# EAGLE schematic dachshund104 (EAGLE 9.7.0)
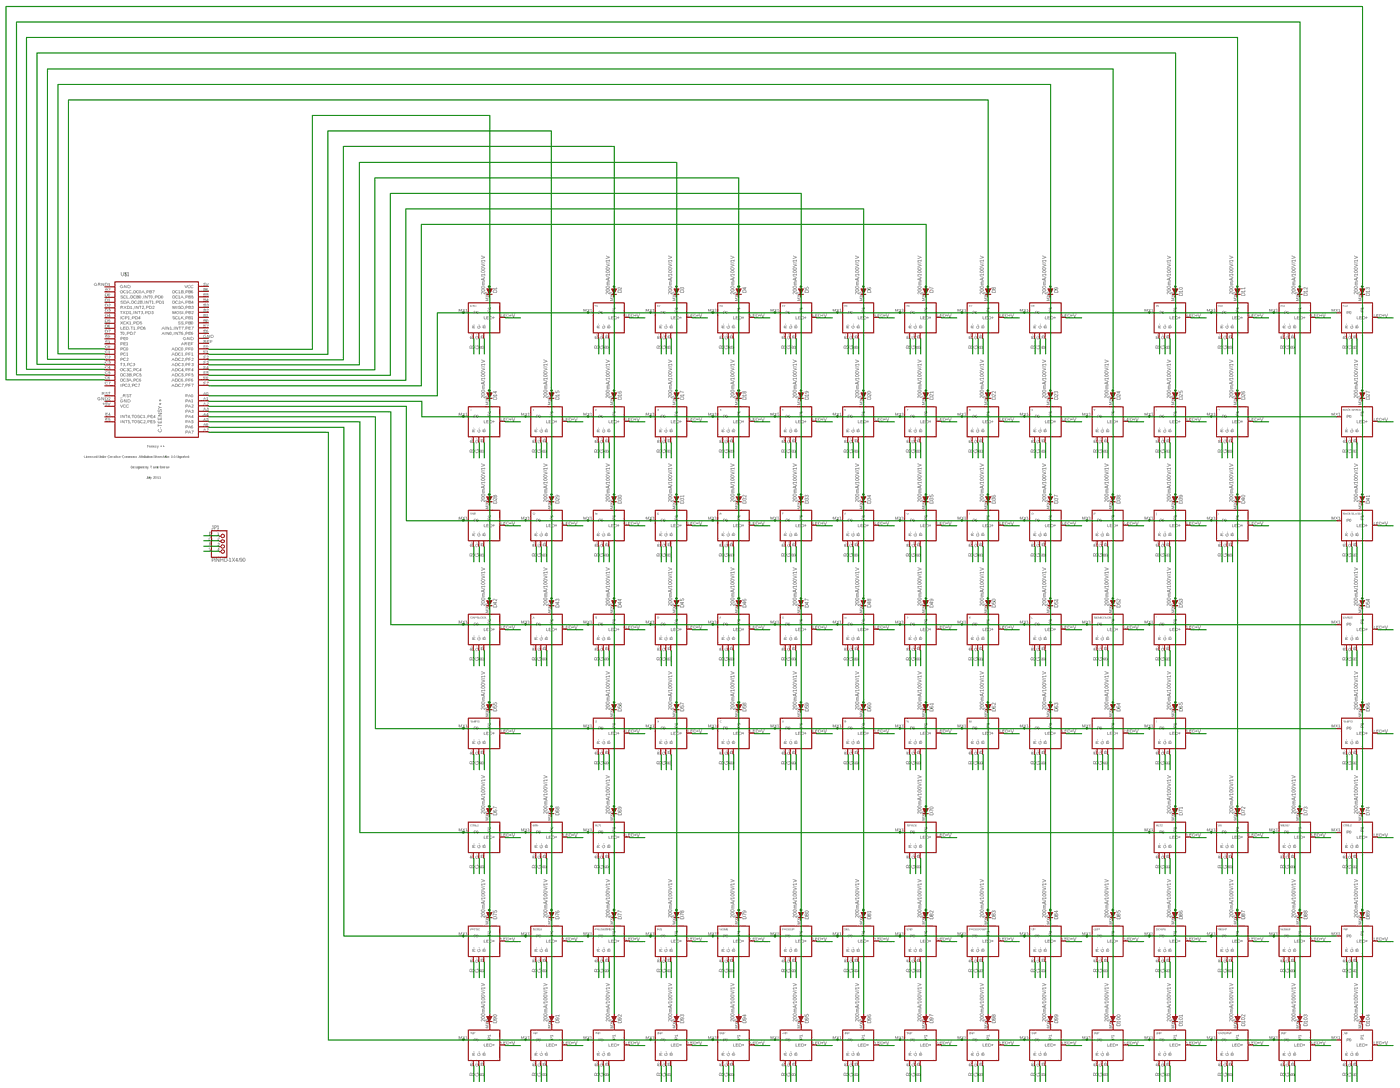
[diagram p0: schematic, sheet 1, overview]
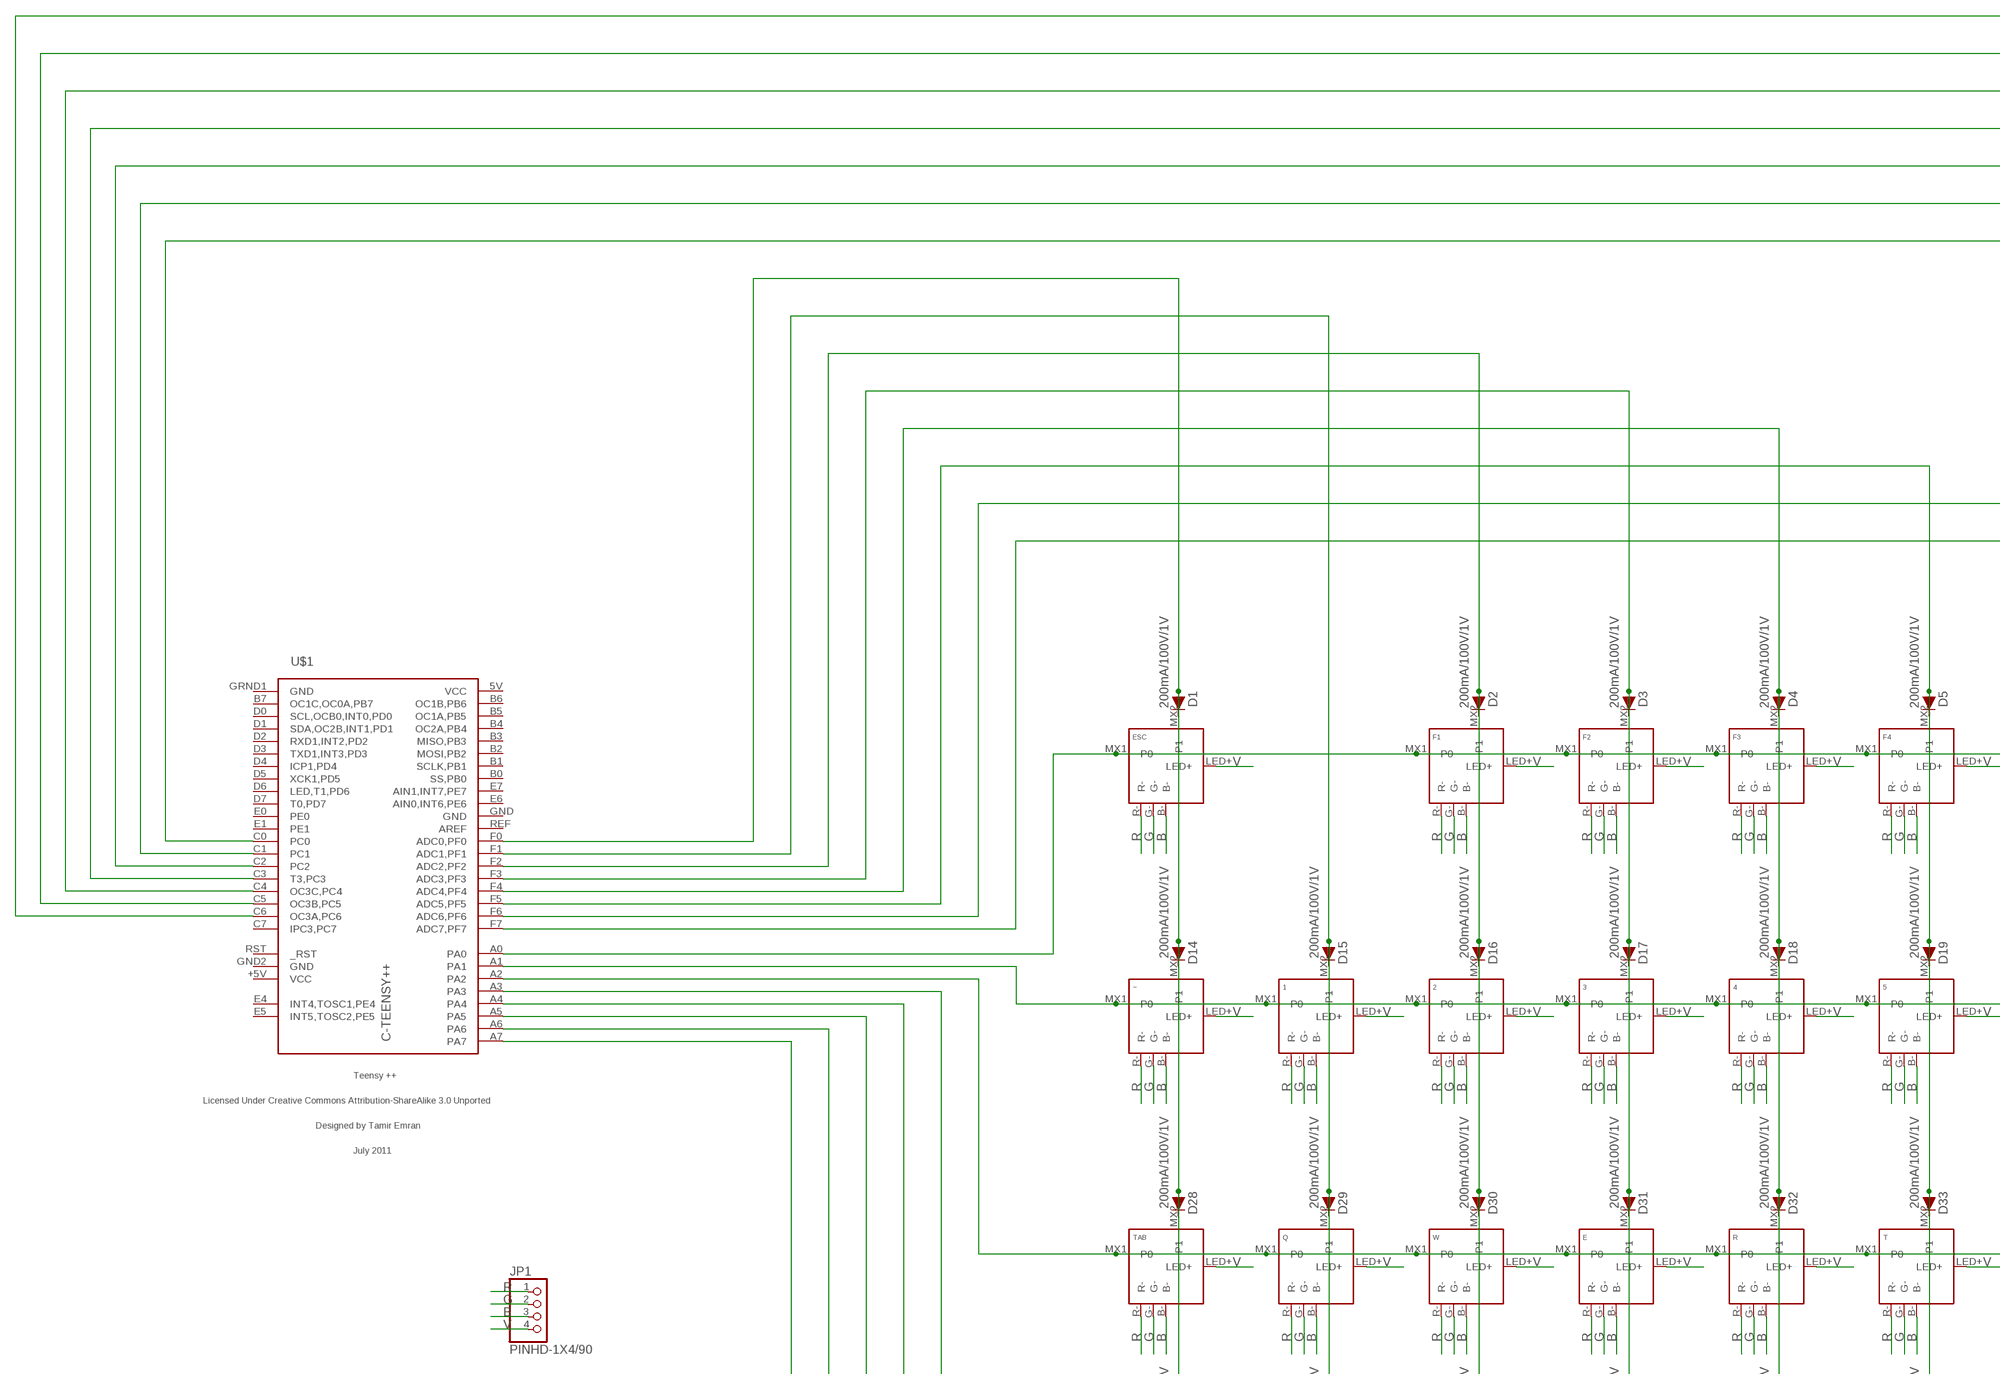
[diagram p1: schematic, sheet 1, part 1 of 4]
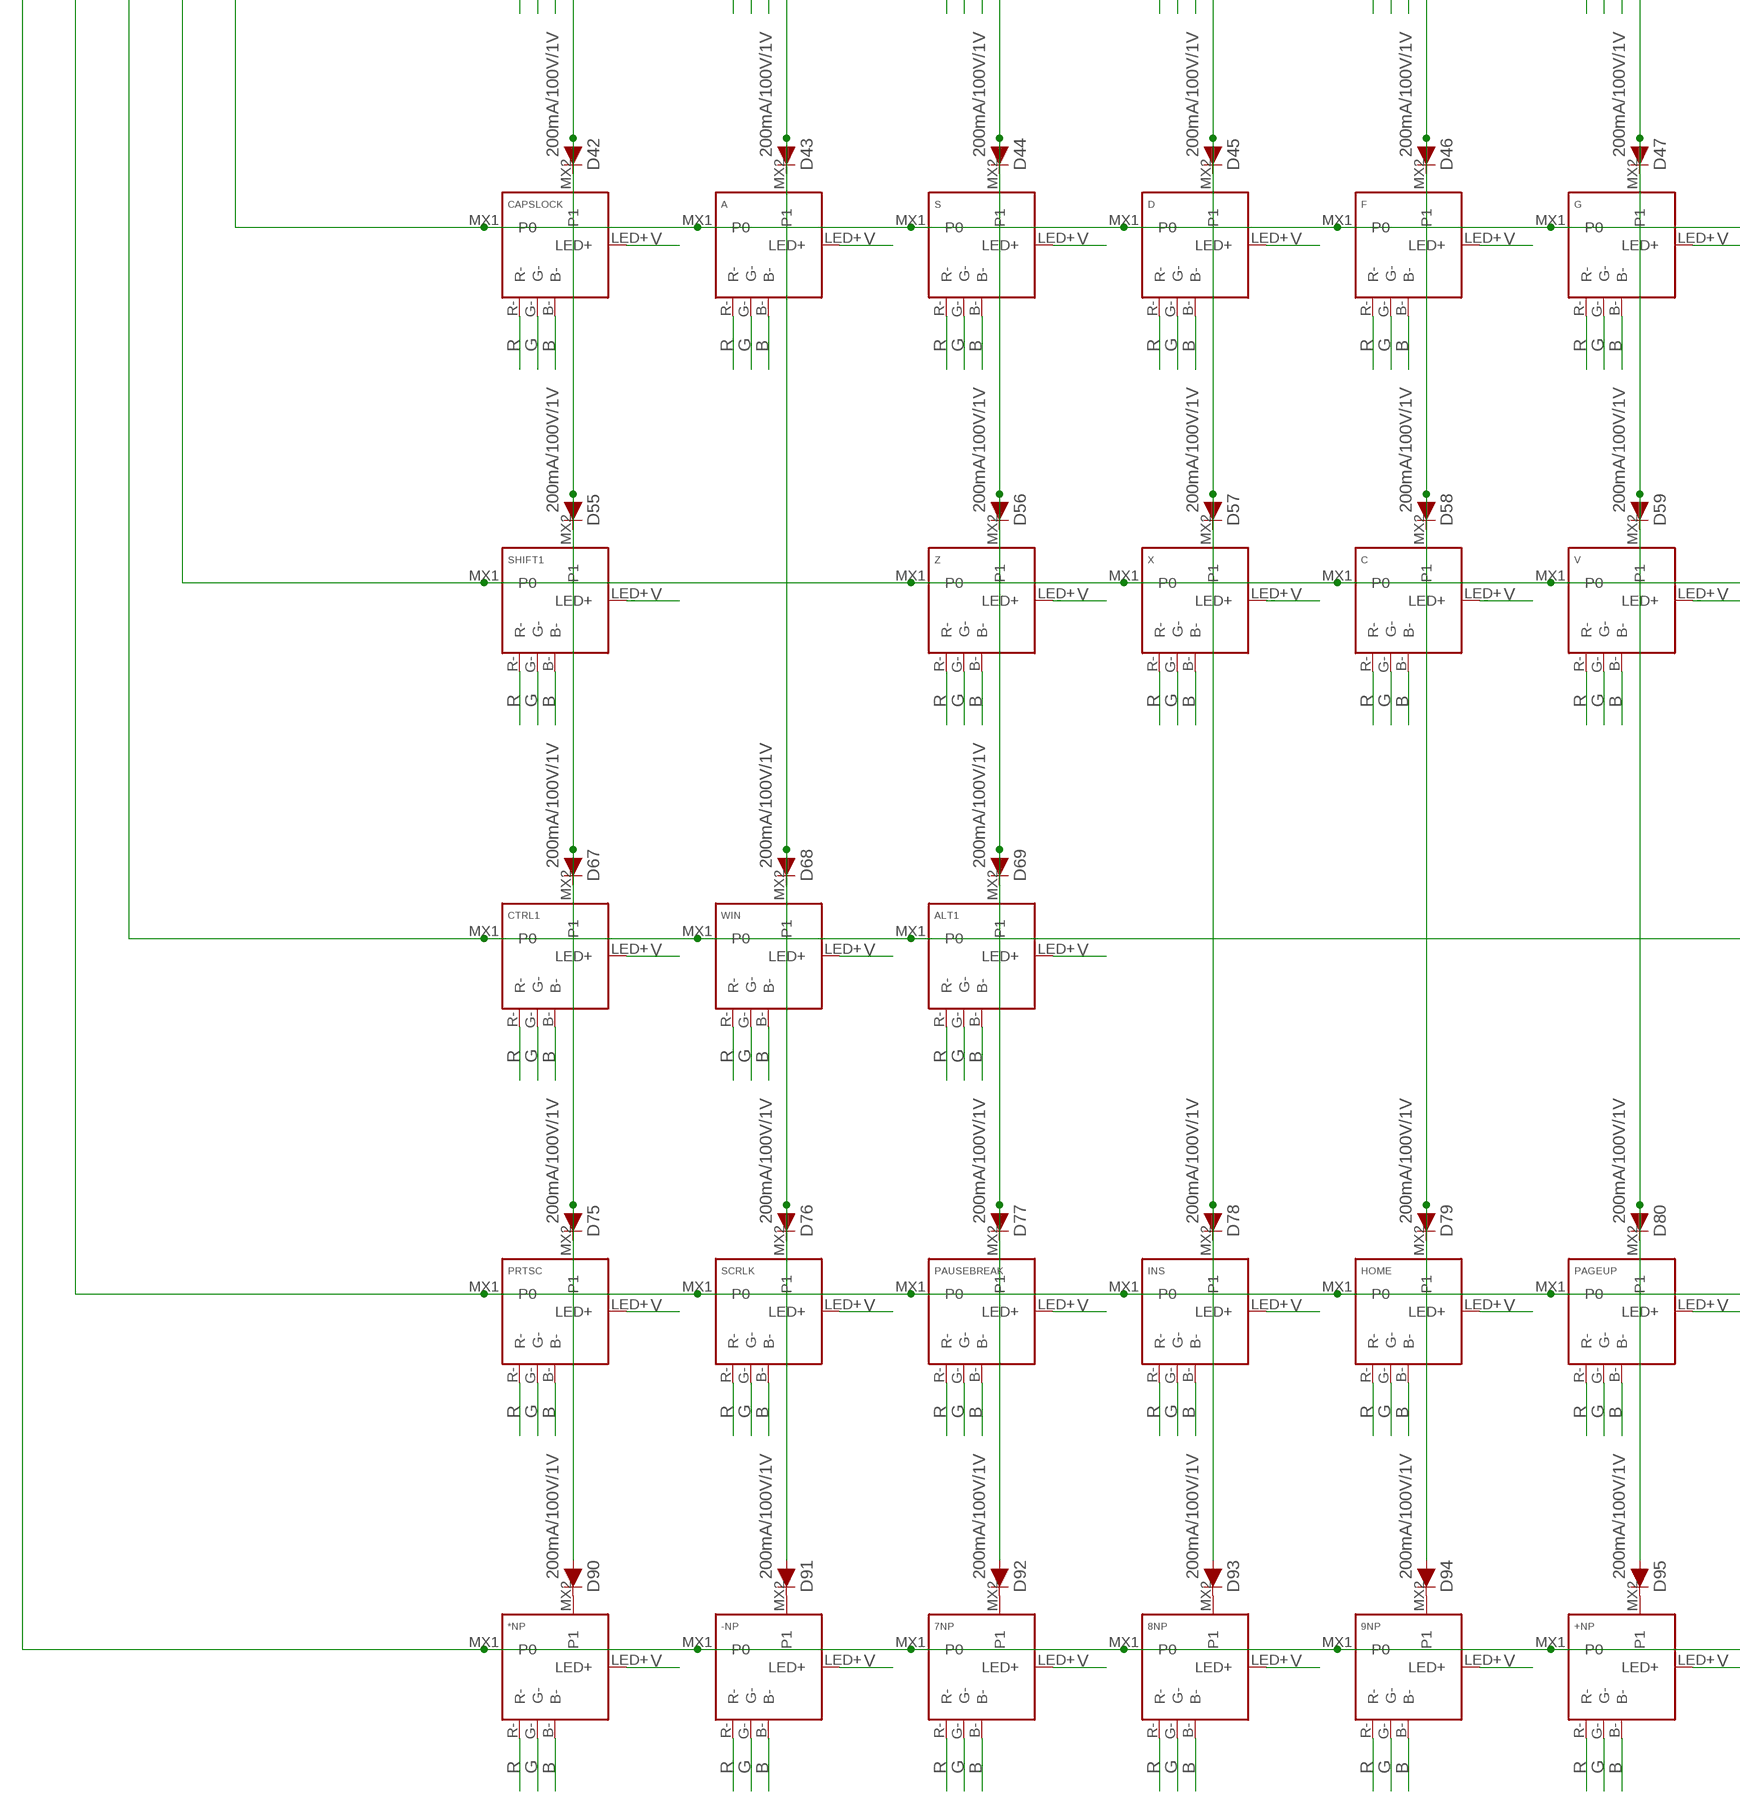
[diagram p2: schematic, sheet 1, part 2 of 4]
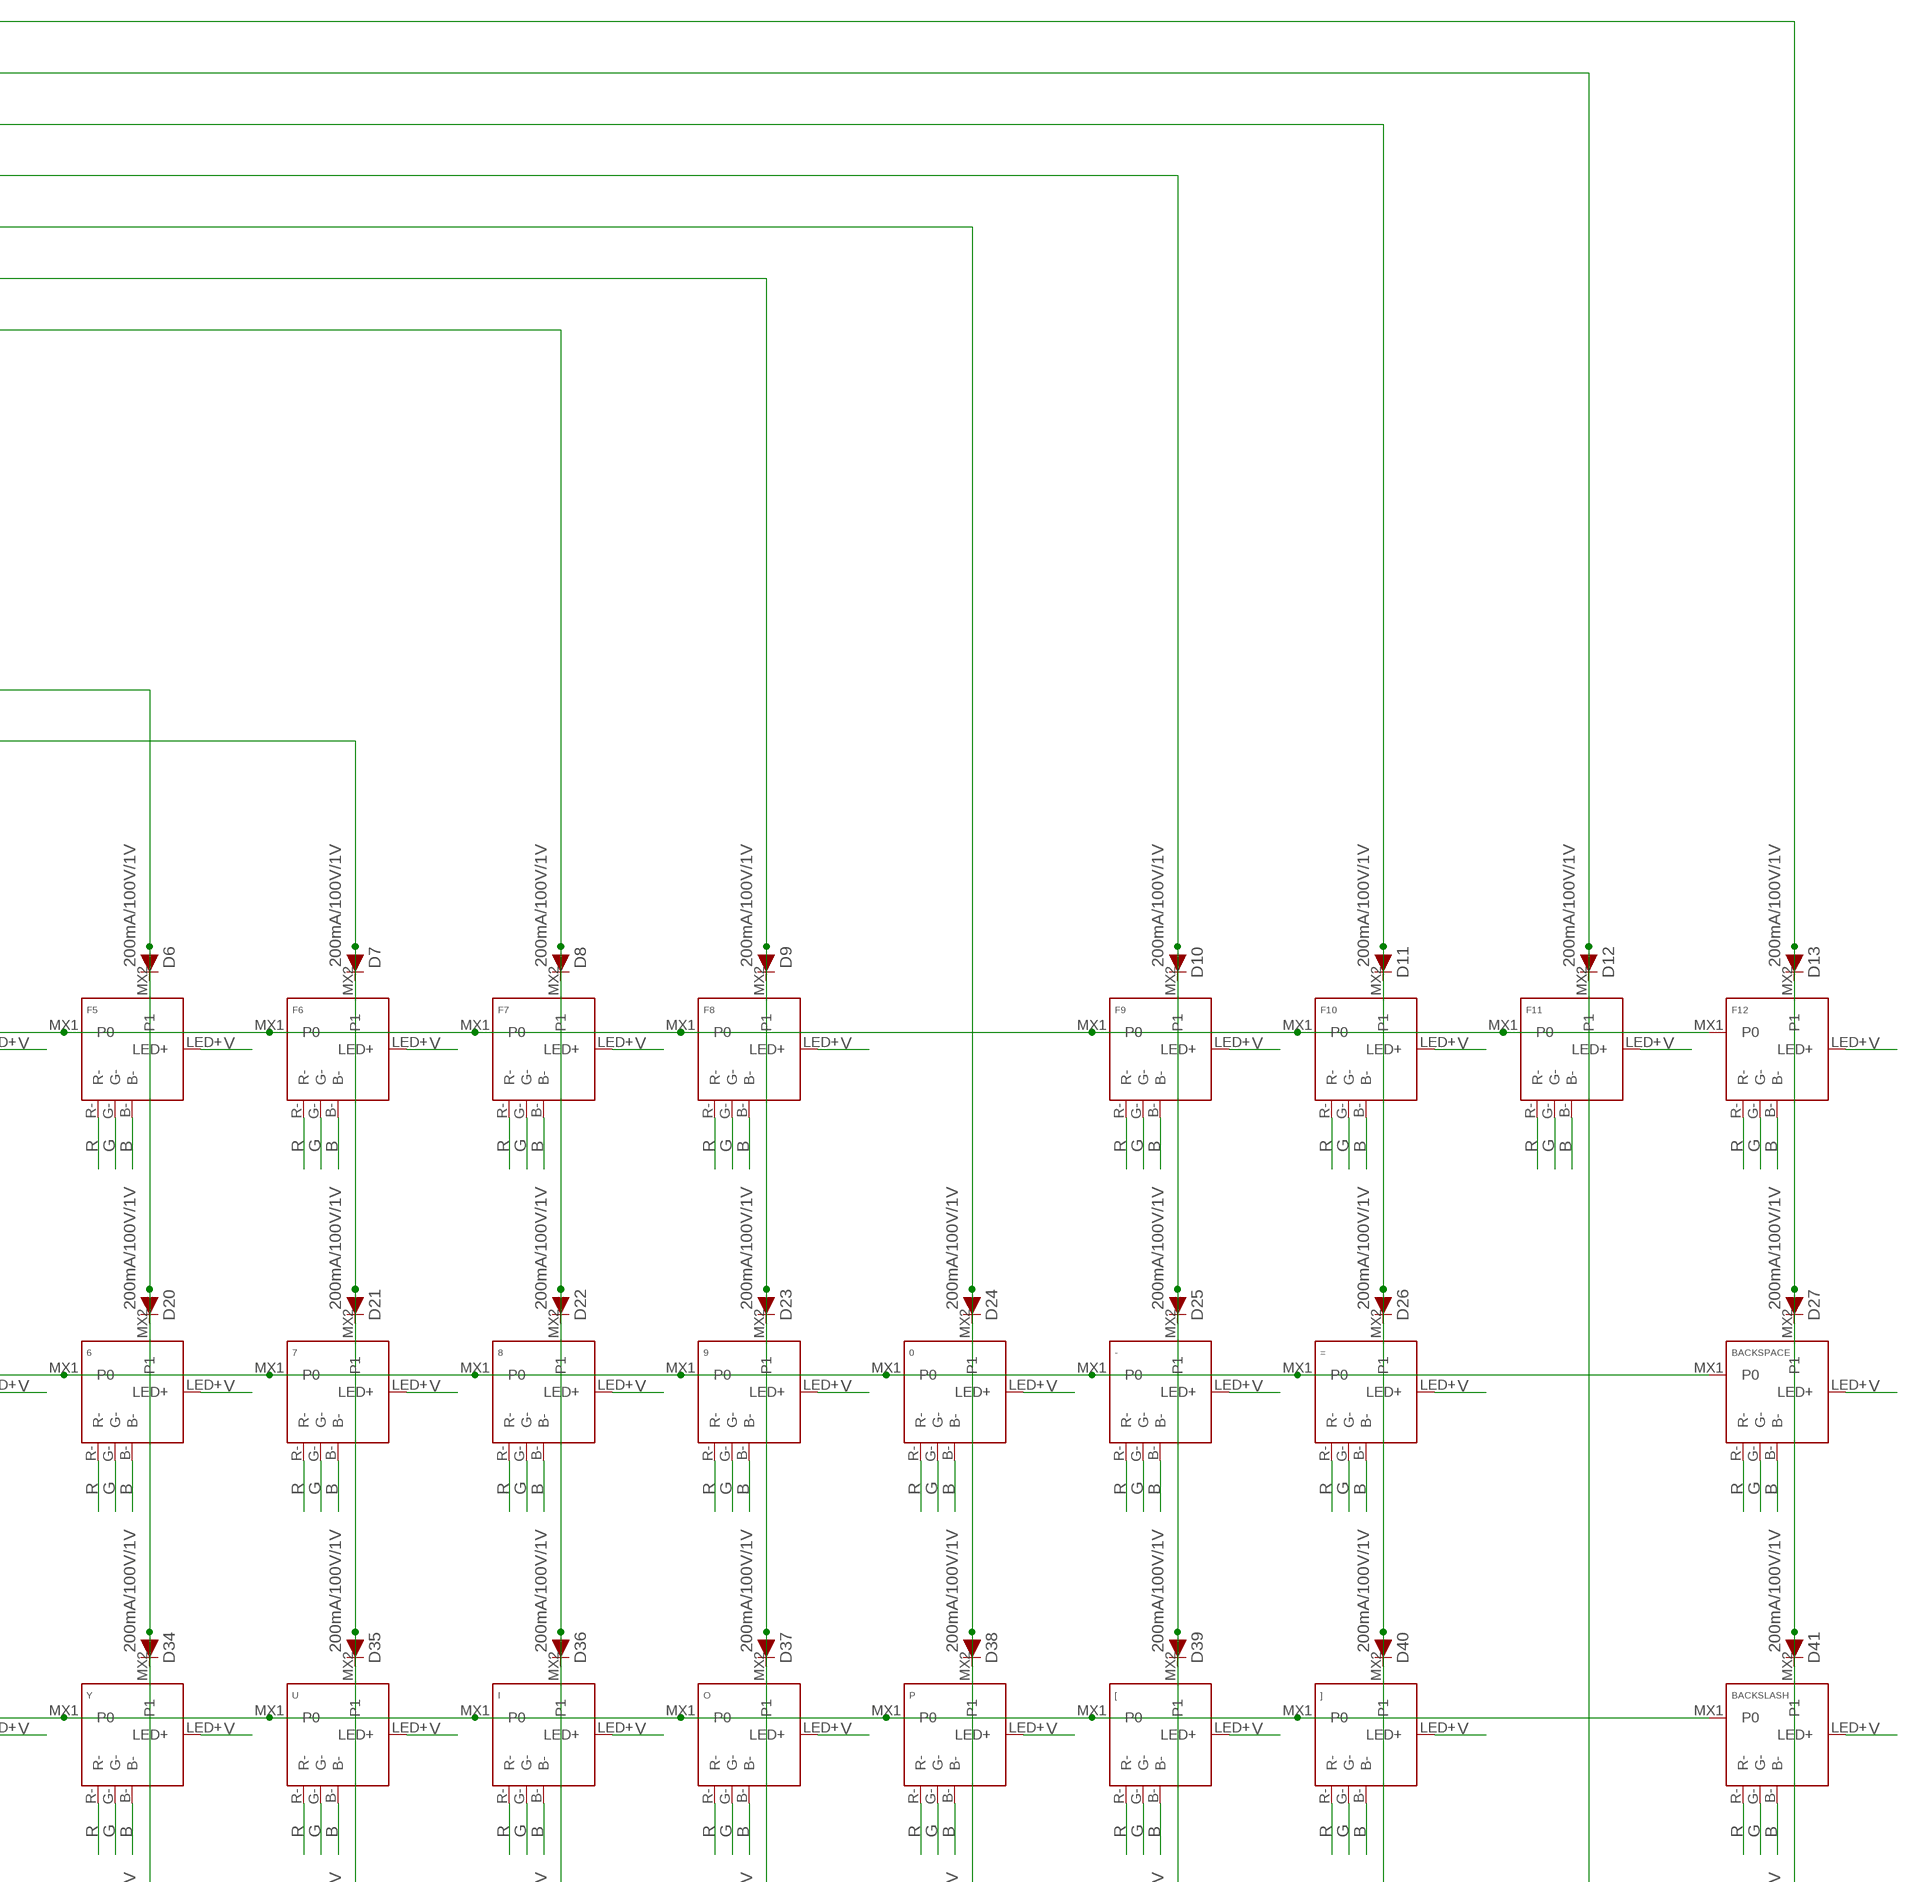
[diagram p3: schematic, sheet 1, part 3 of 4]
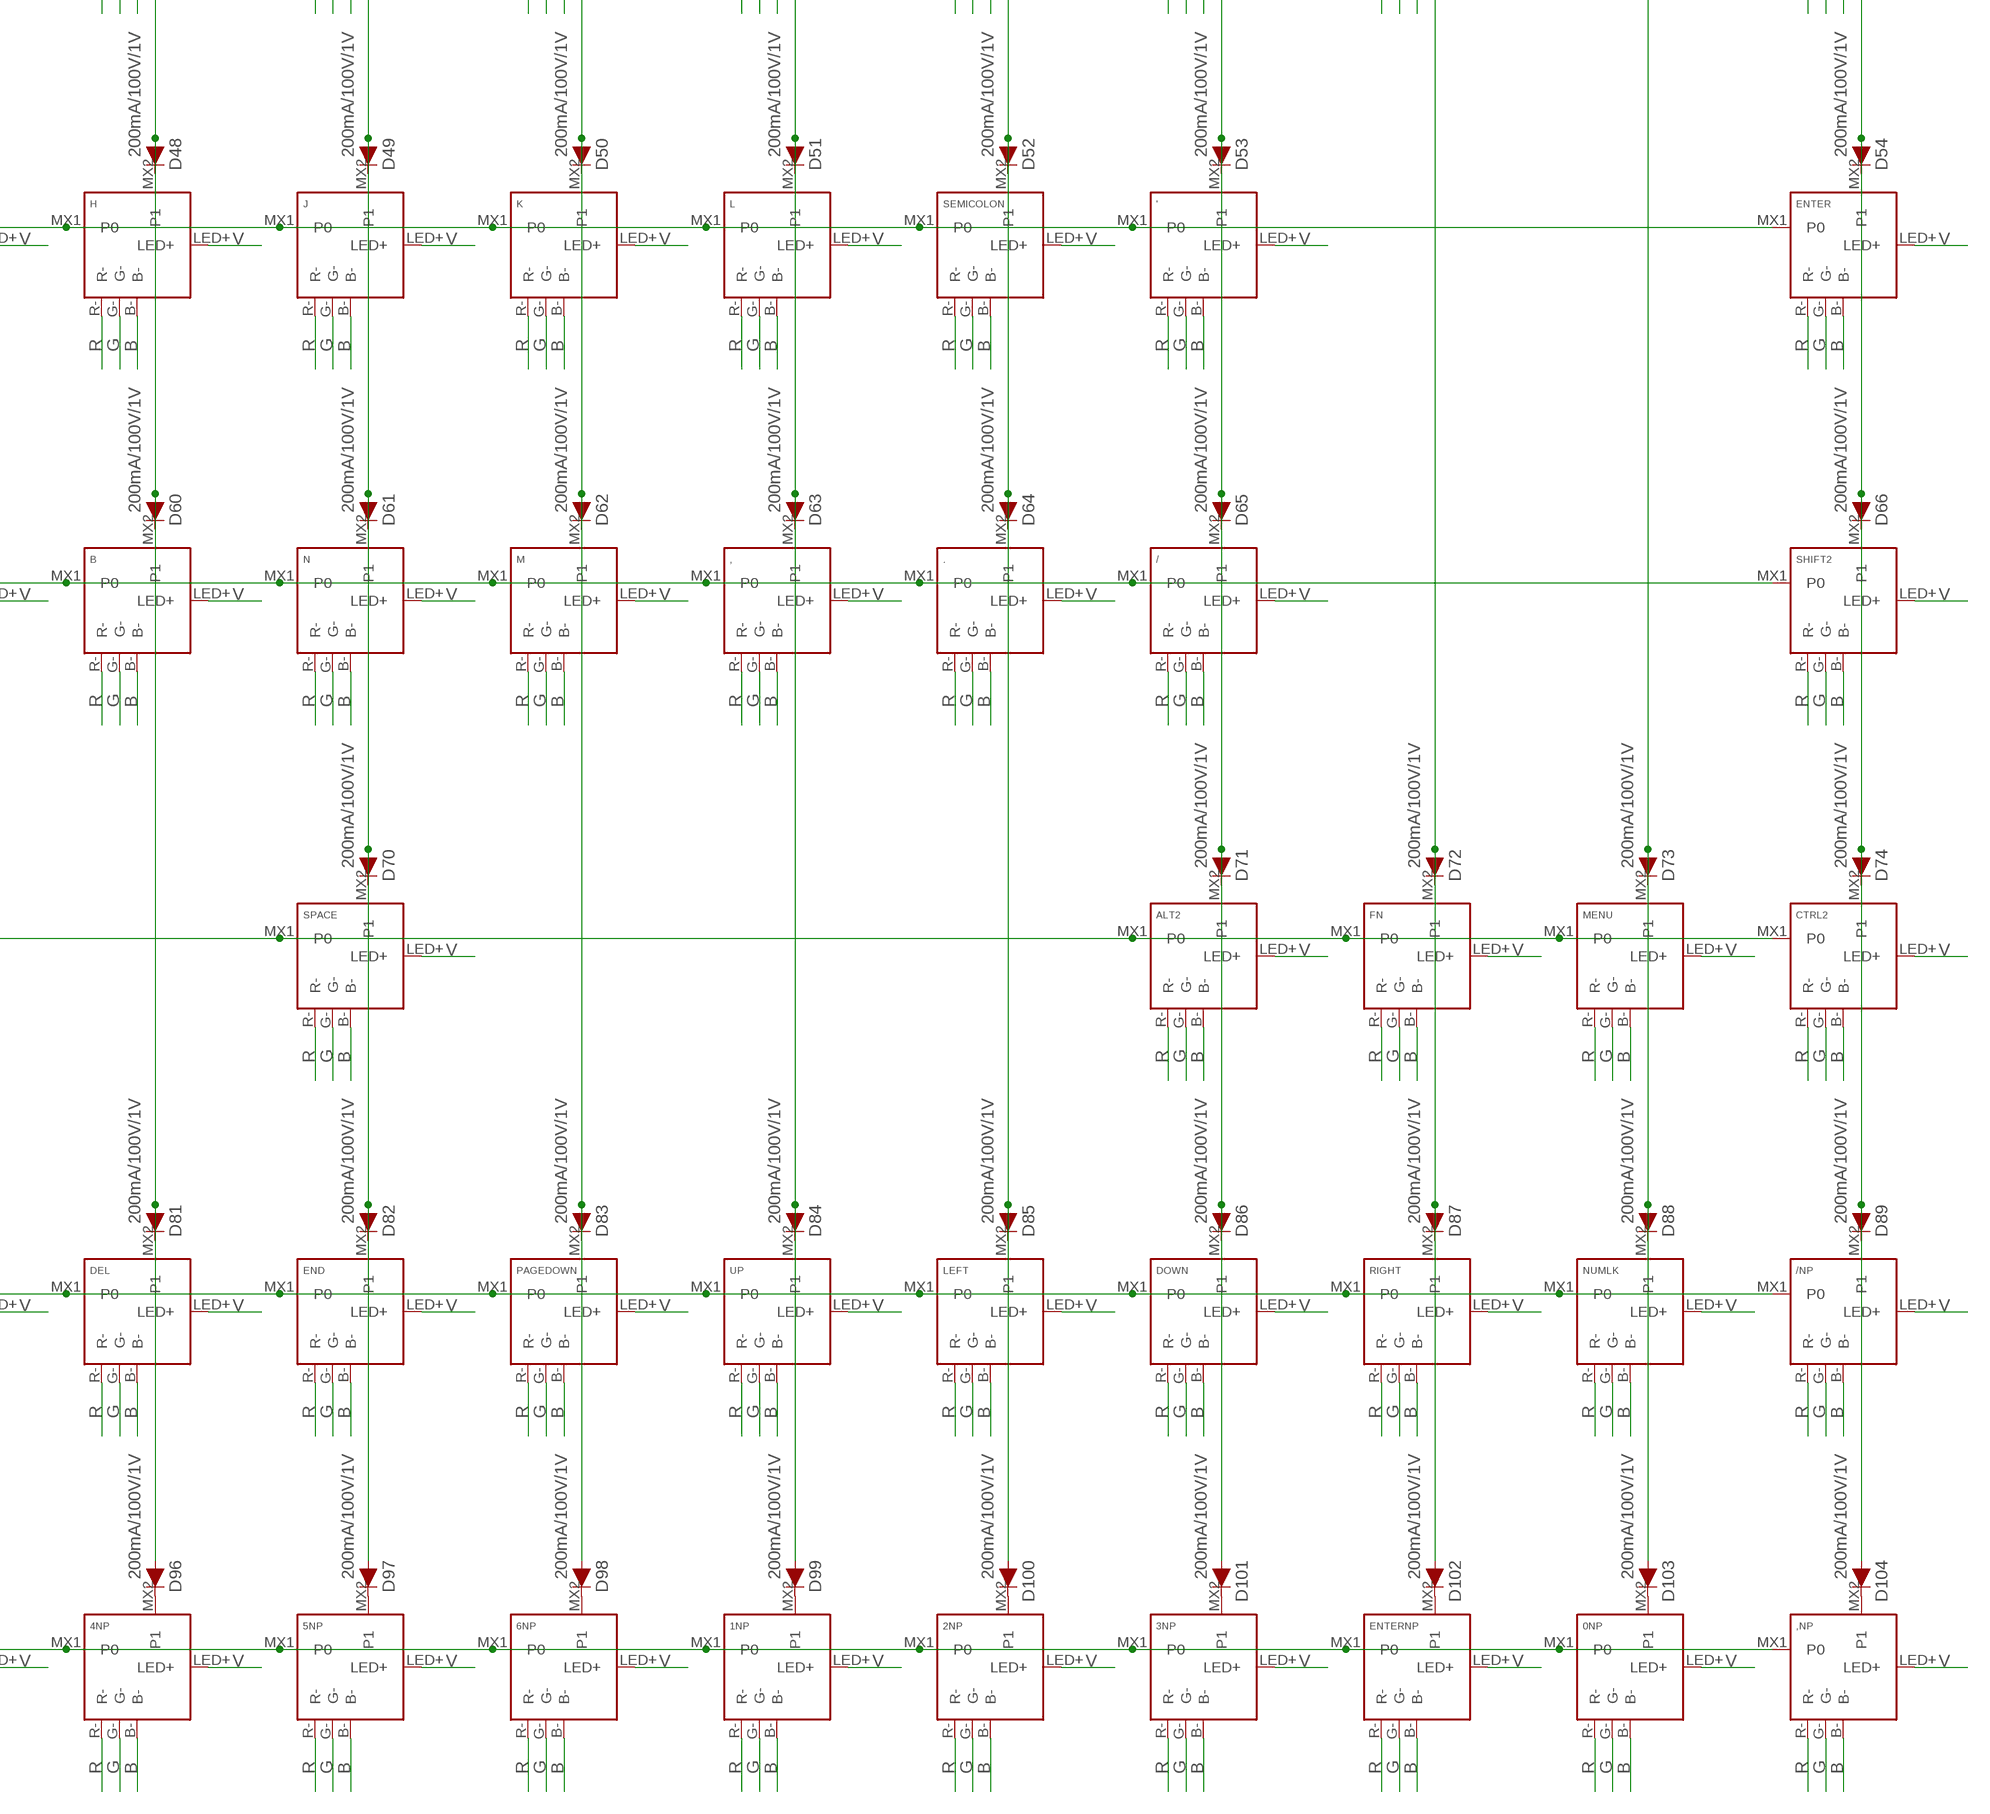
[diagram p4: schematic, sheet 1, part 4 of 4]

## Parts
0  KEYSWITCH-RGBSMDLED-MXHSPCB-1U-SMDRGB  [MXHSPCB-1U-SMDRGB]
0NP  KEYSWITCH-RGBSMDLED-MXHSPCB-2U-SMDRGB  [MXHSPCB-2U-SMDRGB]
1  KEYSWITCH-RGBSMDLED-MXHSPCB-1U-SMDRGB  [MXHSPCB-1U-SMDRGB]
1NP  KEYSWITCH-RGBSMDLED-MXHSPCB-1U-SMDRGB  [MXHSPCB-1U-SMDRGB]
2  KEYSWITCH-RGBSMDLED-MXHSPCB-1U-SMDRGB  [MXHSPCB-1U-SMDRGB]
2NP  KEYSWITCH-RGBSMDLED-MXHSPCB-1U-SMDRGB  [MXHSPCB-1U-SMDRGB]
3  KEYSWITCH-RGBSMDLED-MXHSPCB-1U-SMDRGB  [MXHSPCB-1U-SMDRGB]
3NP  KEYSWITCH-RGBSMDLED-MXHSPCB-1U-SMDRGB  [MXHSPCB-1U-SMDRGB]
4  KEYSWITCH-RGBSMDLED-MXHSPCB-1U-SMDRGB  [MXHSPCB-1U-SMDRGB]
4NP  KEYSWITCH-RGBSMDLED-MXHSPCB-1U-SMDRGB  [MXHSPCB-1U-SMDRGB]
5  KEYSWITCH-RGBSMDLED-MXHSPCB-1U-SMDRGB  [MXHSPCB-1U-SMDRGB]
5NP  KEYSWITCH-RGBSMDLED-MXHSPCB-1U-SMDRGB  [MXHSPCB-1U-SMDRGB]
6  KEYSWITCH-RGBSMDLED-MXHSPCB-1U-SMDRGB  [MXHSPCB-1U-SMDRGB]
6NP  KEYSWITCH-RGBSMDLED-MXHSPCB-1U-SMDRGB  [MXHSPCB-1U-SMDRGB]
7  KEYSWITCH-RGBSMDLED-MXHSPCB-1U-SMDRGB  [MXHSPCB-1U-SMDRGB]
7NP  KEYSWITCH-RGBSMDLED-MXHSPCB-1U-SMDRGB  [MXHSPCB-1U-SMDRGB]
8  KEYSWITCH-RGBSMDLED-MXHSPCB-1U-SMDRGB  [MXHSPCB-1U-SMDRGB]
8NP  KEYSWITCH-RGBSMDLED-MXHSPCB-1U-SMDRGB  [MXHSPCB-1U-SMDRGB]
9  KEYSWITCH-RGBSMDLED-MXHSPCB-1U-SMDRGB  [MXHSPCB-1U-SMDRGB]
9NP  KEYSWITCH-RGBSMDLED-MXHSPCB-1U-SMDRGB  [MXHSPCB-1U-SMDRGB]
'  KEYSWITCH-RGBSMDLED-MXHSPCB-1U-SMDRGB  [MXHSPCB-1U-SMDRGB]
*NP  KEYSWITCH-RGBSMDLED-MXHSPCB-1U-SMDRGB  [MXHSPCB-1U-SMDRGB]
+NP  KEYSWITCH-RGBSMDLED-MXHSPCB-2U-SMDRGB-ROTATED  [MXHSPCB-2U-SMDRGB-ROTATED]
,  KEYSWITCH-RGBSMDLED-MXHSPCB-1U-SMDRGB  [MXHSPCB-1U-SMDRGB]
,NP  KEYSWITCH-RGBSMDLED-MXHSPCB-1U-SMDRGB  [MXHSPCB-1U-SMDRGB]
-  KEYSWITCH-RGBSMDLED-MXHSPCB-1U-SMDRGB  [MXHSPCB-1U-SMDRGB]
-NP  KEYSWITCH-RGBSMDLED-MXHSPCB-1U-SMDRGB  [MXHSPCB-1U-SMDRGB]
.  KEYSWITCH-RGBSMDLED-MXHSPCB-1U-SMDRGB  [MXHSPCB-1U-SMDRGB]
/  KEYSWITCH-RGBSMDLED-MXHSPCB-1U-SMDRGB  [MXHSPCB-1U-SMDRGB]
/NP  KEYSWITCH-RGBSMDLED-MXHSPCB-1U-SMDRGB  [MXHSPCB-1U-SMDRGB]
=  KEYSWITCH-RGBSMDLED-MXHSPCB-1U-SMDRGB  [MXHSPCB-1U-SMDRGB]
[  KEYSWITCH-RGBSMDLED-MXHSPCB-1U-SMDRGB  [MXHSPCB-1U-SMDRGB]
]  KEYSWITCH-RGBSMDLED-MXHSPCB-1U-SMDRGB  [MXHSPCB-1U-SMDRGB]
A  KEYSWITCH-RGBSMDLED-MXHSPCB-1U-SMDRGB  [MXHSPCB-1U-SMDRGB]
ALT1  KEYSWITCH-RGBSMDLED-MXHSPCB-1U-SMDRGB  [MXHSPCB-1U-SMDRGB]
ALT2  KEYSWITCH-RGBSMDLED-MXHSPCB-1U-SMDRGB  [MXHSPCB-1U-SMDRGB]
B  KEYSWITCH-RGBSMDLED-MXHSPCB-1U-SMDRGB  [MXHSPCB-1U-SMDRGB]
BACKSLASH  KEYSWITCH-RGBSMDLED-MXHSPCB-1U-SMDRGB  [MXHSPCB-1U-SMDRGB]
BACKSPACE  KEYSWITCH-RGBSMDLED-MXHSPCB-2U-SMDRGB  [MXHSPCB-2U-SMDRGB]
C  KEYSWITCH-RGBSMDLED-MXHSPCB-1U-SMDRGB  [MXHSPCB-1U-SMDRGB]
CAPSLOCK  KEYSWITCH-RGBSMDLED-MXHSPCB-1U-SMDRGB  [MXHSPCB-1U-SMDRGB]
CTRL1  KEYSWITCH-RGBSMDLED-MXHSPCB-1U-SMDRGB  [MXHSPCB-1U-SMDRGB]
CTRL2  KEYSWITCH-RGBSMDLED-MXHSPCB-1U-SMDRGB  [MXHSPCB-1U-SMDRGB]
D  KEYSWITCH-RGBSMDLED-MXHSPCB-1U-SMDRGB  [MXHSPCB-1U-SMDRGB]
D1  200mA/100V/1V  DIODE-1N4148  [DIODE-1N4148]
D2  200mA/100V/1V  DIODE-1N4148  [DIODE-1N4148]
D3  200mA/100V/1V  DIODE-1N4148  [DIODE-1N4148]
D4  200mA/100V/1V  DIODE-1N4148  [DIODE-1N4148]
D5  200mA/100V/1V  DIODE-1N4148  [DIODE-1N4148]
D6  200mA/100V/1V  DIODE-1N4148  [DIODE-1N4148]
D7  200mA/100V/1V  DIODE-1N4148  [DIODE-1N4148]
D8  200mA/100V/1V  DIODE-1N4148  [DIODE-1N4148]
D9  200mA/100V/1V  DIODE-1N4148  [DIODE-1N4148]
D10  200mA/100V/1V  DIODE-1N4148  [DIODE-1N4148]
D11  200mA/100V/1V  DIODE-1N4148  [DIODE-1N4148]
D12  200mA/100V/1V  DIODE-1N4148  [DIODE-1N4148]
D13  200mA/100V/1V  DIODE-1N4148  [DIODE-1N4148]
D14  200mA/100V/1V  DIODE-1N4148  [DIODE-1N4148]
D15  200mA/100V/1V  DIODE-1N4148  [DIODE-1N4148]
D16  200mA/100V/1V  DIODE-1N4148  [DIODE-1N4148]
D17  200mA/100V/1V  DIODE-1N4148  [DIODE-1N4148]
D18  200mA/100V/1V  DIODE-1N4148  [DIODE-1N4148]
D19  200mA/100V/1V  DIODE-1N4148  [DIODE-1N4148]
D20  200mA/100V/1V  DIODE-1N4148  [DIODE-1N4148]
D21  200mA/100V/1V  DIODE-1N4148  [DIODE-1N4148]
D22  200mA/100V/1V  DIODE-1N4148  [DIODE-1N4148]
D23  200mA/100V/1V  DIODE-1N4148  [DIODE-1N4148]
D24  200mA/100V/1V  DIODE-1N4148  [DIODE-1N4148]
D25  200mA/100V/1V  DIODE-1N4148  [DIODE-1N4148]
D26  200mA/100V/1V  DIODE-1N4148  [DIODE-1N4148]
D27  200mA/100V/1V  DIODE-1N4148  [DIODE-1N4148]
D28  200mA/100V/1V  DIODE-1N4148  [DIODE-1N4148]
D29  200mA/100V/1V  DIODE-1N4148  [DIODE-1N4148]
D30  200mA/100V/1V  DIODE-1N4148  [DIODE-1N4148]
D31  200mA/100V/1V  DIODE-1N4148  [DIODE-1N4148]
D32  200mA/100V/1V  DIODE-1N4148  [DIODE-1N4148]
D33  200mA/100V/1V  DIODE-1N4148  [DIODE-1N4148]
D34  200mA/100V/1V  DIODE-1N4148  [DIODE-1N4148]
D35  200mA/100V/1V  DIODE-1N4148  [DIODE-1N4148]
D36  200mA/100V/1V  DIODE-1N4148  [DIODE-1N4148]
D37  200mA/100V/1V  DIODE-1N4148  [DIODE-1N4148]
D38  200mA/100V/1V  DIODE-1N4148  [DIODE-1N4148]
D39  200mA/100V/1V  DIODE-1N4148  [DIODE-1N4148]
D40  200mA/100V/1V  DIODE-1N4148  [DIODE-1N4148]
D41  200mA/100V/1V  DIODE-1N4148  [DIODE-1N4148]
D42  200mA/100V/1V  DIODE-1N4148  [DIODE-1N4148]
D43  200mA/100V/1V  DIODE-1N4148  [DIODE-1N4148]
D44  200mA/100V/1V  DIODE-1N4148  [DIODE-1N4148]
D45  200mA/100V/1V  DIODE-1N4148  [DIODE-1N4148]
D46  200mA/100V/1V  DIODE-1N4148  [DIODE-1N4148]
D47  200mA/100V/1V  DIODE-1N4148  [DIODE-1N4148]
D48  200mA/100V/1V  DIODE-1N4148  [DIODE-1N4148]
D49  200mA/100V/1V  DIODE-1N4148  [DIODE-1N4148]
D50  200mA/100V/1V  DIODE-1N4148  [DIODE-1N4148]
D51  200mA/100V/1V  DIODE-1N4148  [DIODE-1N4148]
D52  200mA/100V/1V  DIODE-1N4148  [DIODE-1N4148]
D53  200mA/100V/1V  DIODE-1N4148  [DIODE-1N4148]
D54  200mA/100V/1V  DIODE-1N4148  [DIODE-1N4148]
D55  200mA/100V/1V  DIODE-1N4148  [DIODE-1N4148]
D56  200mA/100V/1V  DIODE-1N4148  [DIODE-1N4148]
D57  200mA/100V/1V  DIODE-1N4148  [DIODE-1N4148]
D58  200mA/100V/1V  DIODE-1N4148  [DIODE-1N4148]
D59  200mA/100V/1V  DIODE-1N4148  [DIODE-1N4148]
D60  200mA/100V/1V  DIODE-1N4148  [DIODE-1N4148]
D61  200mA/100V/1V  DIODE-1N4148  [DIODE-1N4148]
D62  200mA/100V/1V  DIODE-1N4148  [DIODE-1N4148]
D63  200mA/100V/1V  DIODE-1N4148  [DIODE-1N4148]
D64  200mA/100V/1V  DIODE-1N4148  [DIODE-1N4148]
D65  200mA/100V/1V  DIODE-1N4148  [DIODE-1N4148]
D66  200mA/100V/1V  DIODE-1N4148  [DIODE-1N4148]
D67  200mA/100V/1V  DIODE-1N4148  [DIODE-1N4148]
D68  200mA/100V/1V  DIODE-1N4148  [DIODE-1N4148]
D69  200mA/100V/1V  DIODE-1N4148  [DIODE-1N4148]
D70  200mA/100V/1V  DIODE-1N4148  [DIODE-1N4148]
D71  200mA/100V/1V  DIODE-1N4148  [DIODE-1N4148]
D72  200mA/100V/1V  DIODE-1N4148  [DIODE-1N4148]
D73  200mA/100V/1V  DIODE-1N4148  [DIODE-1N4148]
D74  200mA/100V/1V  DIODE-1N4148  [DIODE-1N4148]
D75  200mA/100V/1V  DIODE-1N4148  [DIODE-1N4148]
D76  200mA/100V/1V  DIODE-1N4148  [DIODE-1N4148]
D77  200mA/100V/1V  DIODE-1N4148  [DIODE-1N4148]
D78  200mA/100V/1V  DIODE-1N4148  [DIODE-1N4148]
D79  200mA/100V/1V  DIODE-1N4148  [DIODE-1N4148]
D80  200mA/100V/1V  DIODE-1N4148  [DIODE-1N4148]
D81  200mA/100V/1V  DIODE-1N4148  [DIODE-1N4148]
D82  200mA/100V/1V  DIODE-1N4148  [DIODE-1N4148]
D83  200mA/100V/1V  DIODE-1N4148  [DIODE-1N4148]
D84  200mA/100V/1V  DIODE-1N4148  [DIODE-1N4148]
D85  200mA/100V/1V  DIODE-1N4148  [DIODE-1N4148]
D86  200mA/100V/1V  DIODE-1N4148  [DIODE-1N4148]
D87  200mA/100V/1V  DIODE-1N4148  [DIODE-1N4148]
D88  200mA/100V/1V  DIODE-1N4148  [DIODE-1N4148]
D89  200mA/100V/1V  DIODE-1N4148  [DIODE-1N4148]
D90  200mA/100V/1V  DIODE-1N4148  [DIODE-1N4148]
D91  200mA/100V/1V  DIODE-1N4148  [DIODE-1N4148]
D92  200mA/100V/1V  DIODE-1N4148  [DIODE-1N4148]
D93  200mA/100V/1V  DIODE-1N4148  [DIODE-1N4148]
D94  200mA/100V/1V  DIODE-1N4148  [DIODE-1N4148]
D95  200mA/100V/1V  DIODE-1N4148  [DIODE-1N4148]
D96  200mA/100V/1V  DIODE-1N4148  [DIODE-1N4148]
D97  200mA/100V/1V  DIODE-1N4148  [DIODE-1N4148]
D98  200mA/100V/1V  DIODE-1N4148  [DIODE-1N4148]
D99  200mA/100V/1V  DIODE-1N4148  [DIODE-1N4148]
D100  200mA/100V/1V  DIODE-1N4148  [DIODE-1N4148]
D101  200mA/100V/1V  DIODE-1N4148  [DIODE-1N4148]
D102  200mA/100V/1V  DIODE-1N4148  [DIODE-1N4148]
D103  200mA/100V/1V  DIODE-1N4148  [DIODE-1N4148]
D104  200mA/100V/1V  DIODE-1N4148  [DIODE-1N4148]
DEL  KEYSWITCH-RGBSMDLED-MXHSPCB-1U-SMDRGB  [MXHSPCB-1U-SMDRGB]
DOWN  KEYSWITCH-RGBSMDLED-MXHSPCB-1U-SMDRGB  [MXHSPCB-1U-SMDRGB]
E  KEYSWITCH-RGBSMDLED-MXHSPCB-1U-SMDRGB  [MXHSPCB-1U-SMDRGB]
END  KEYSWITCH-RGBSMDLED-MXHSPCB-1U-SMDRGB  [MXHSPCB-1U-SMDRGB]
ENTER  KEYSWITCH-RGBSMDLED-MXHSPCB-2U-SMDRGB  [MXHSPCB-2U-SMDRGB]
ENTERNP  KEYSWITCH-RGBSMDLED-MXHSPCB-2U-SMDRGB-ROTATED  [MXHSPCB-2U-SMDRGB-ROTATED]
ESC  KEYSWITCH-RGBSMDLED-MXHSPCB-1U-SMDRGB  [MXHSPCB-1U-SMDRGB]
F  KEYSWITCH-RGBSMDLED-MXHSPCB-1U-SMDRGB  [MXHSPCB-1U-SMDRGB]
F1  KEYSWITCH-RGBSMDLED-MXHSPCB-1U-SMDRGB  [MXHSPCB-1U-SMDRGB]
F2  KEYSWITCH-RGBSMDLED-MXHSPCB-1U-SMDRGB  [MXHSPCB-1U-SMDRGB]
F3  KEYSWITCH-RGBSMDLED-MXHSPCB-1U-SMDRGB  [MXHSPCB-1U-SMDRGB]
F4  KEYSWITCH-RGBSMDLED-MXHSPCB-1U-SMDRGB  [MXHSPCB-1U-SMDRGB]
F5  KEYSWITCH-RGBSMDLED-MXHSPCB-1U-SMDRGB  [MXHSPCB-1U-SMDRGB]
F6  KEYSWITCH-RGBSMDLED-MXHSPCB-1U-SMDRGB  [MXHSPCB-1U-SMDRGB]
F7  KEYSWITCH-RGBSMDLED-MXHSPCB-1U-SMDRGB  [MXHSPCB-1U-SMDRGB]
F8  KEYSWITCH-RGBSMDLED-MXHSPCB-1U-SMDRGB  [MXHSPCB-1U-SMDRGB]
F9  KEYSWITCH-RGBSMDLED-MXHSPCB-1U-SMDRGB  [MXHSPCB-1U-SMDRGB]
F10  KEYSWITCH-RGBSMDLED-MXHSPCB-1U-SMDRGB  [MXHSPCB-1U-SMDRGB]
F11  KEYSWITCH-RGBSMDLED-MXHSPCB-1U-SMDRGB  [MXHSPCB-1U-SMDRGB]
F12  KEYSWITCH-RGBSMDLED-MXHSPCB-1U-SMDRGB  [MXHSPCB-1U-SMDRGB]
FN  KEYSWITCH-RGBSMDLED-MXHSPCB-1U-SMDRGB  [MXHSPCB-1U-SMDRGB]
G  KEYSWITCH-RGBSMDLED-MXHSPCB-1U-SMDRGB  [MXHSPCB-1U-SMDRGB]
H  KEYSWITCH-RGBSMDLED-MXHSPCB-1U-SMDRGB  [MXHSPCB-1U-SMDRGB]
HOME  KEYSWITCH-RGBSMDLED-MXHSPCB-1U-SMDRGB  [MXHSPCB-1U-SMDRGB]
I  KEYSWITCH-RGBSMDLED-MXHSPCB-1U-SMDRGB  [MXHSPCB-1U-SMDRGB]
INS  KEYSWITCH-RGBSMDLED-MXHSPCB-1U-SMDRGB  [MXHSPCB-1U-SMDRGB]
J  KEYSWITCH-RGBSMDLED-MXHSPCB-1U-SMDRGB  [MXHSPCB-1U-SMDRGB]
JP1  PINHD-1X4/90  [1X04/90]
K  KEYSWITCH-RGBSMDLED-MXHSPCB-1U-SMDRGB  [MXHSPCB-1U-SMDRGB]
L  KEYSWITCH-RGBSMDLED-MXHSPCB-1U-SMDRGB  [MXHSPCB-1U-SMDRGB]
LEFT  KEYSWITCH-RGBSMDLED-MXHSPCB-1U-SMDRGB  [MXHSPCB-1U-SMDRGB]
M  KEYSWITCH-RGBSMDLED-MXHSPCB-1U-SMDRGB  [MXHSPCB-1U-SMDRGB]
MENU  KEYSWITCH-RGBSMDLED-MXHSPCB-1U-SMDRGB  [MXHSPCB-1U-SMDRGB]
N  KEYSWITCH-RGBSMDLED-MXHSPCB-1U-SMDRGB  [MXHSPCB-1U-SMDRGB]
NUMLK  KEYSWITCH-RGBSMDLED-MXHSPCB-1U-SMDRGB  [MXHSPCB-1U-SMDRGB]
O  KEYSWITCH-RGBSMDLED-MXHSPCB-1U-SMDRGB  [MXHSPCB-1U-SMDRGB]
P  KEYSWITCH-RGBSMDLED-MXHSPCB-1U-SMDRGB  [MXHSPCB-1U-SMDRGB]
PAGEDOWN  KEYSWITCH-RGBSMDLED-MXHSPCB-1U-SMDRGB  [MXHSPCB-1U-SMDRGB]
PAGEUP  KEYSWITCH-RGBSMDLED-MXHSPCB-1U-SMDRGB  [MXHSPCB-1U-SMDRGB]
PAUSEBREAK  KEYSWITCH-RGBSMDLED-MXHSPCB-1U-SMDRGB  [MXHSPCB-1U-SMDRGB]
PRTSC  KEYSWITCH-RGBSMDLED-MXHSPCB-1U-SMDRGB  [MXHSPCB-1U-SMDRGB]
Q  KEYSWITCH-RGBSMDLED-MXHSPCB-1U-SMDRGB  [MXHSPCB-1U-SMDRGB]
R  KEYSWITCH-RGBSMDLED-MXHSPCB-1U-SMDRGB  [MXHSPCB-1U-SMDRGB]
RIGHT  KEYSWITCH-RGBSMDLED-MXHSPCB-1U-SMDRGB  [MXHSPCB-1U-SMDRGB]
S  KEYSWITCH-RGBSMDLED-MXHSPCB-1U-SMDRGB  [MXHSPCB-1U-SMDRGB]
SCRLK  KEYSWITCH-RGBSMDLED-MXHSPCB-1U-SMDRGB  [MXHSPCB-1U-SMDRGB]
SEMICOLON  KEYSWITCH-RGBSMDLED-MXHSPCB-1U-SMDRGB  [MXHSPCB-1U-SMDRGB]
SHIFT1  KEYSWITCH-RGBSMDLED-MXHSPCB-2U-SMDRGB  [MXHSPCB-2U-SMDRGB]
SHIFT2  KEYSWITCH-RGBSMDLED-MXHSPCB-2U-SMDRGB  [MXHSPCB-2U-SMDRGB]
SPACE  KEYSWITCH-RGBSMDLED-MXHSPCB-6.25U-SMDRGB  [MXHSPCB-6.25U-SMDRGB]
T  KEYSWITCH-RGBSMDLED-MXHSPCB-1U-SMDRGB  [MXHSPCB-1U-SMDRGB]
TAB  KEYSWITCH-RGBSMDLED-MXHSPCB-1U-SMDRGB  [MXHSPCB-1U-SMDRGB]
U  KEYSWITCH-RGBSMDLED-MXHSPCB-1U-SMDRGB  [MXHSPCB-1U-SMDRGB]
U$1  C-TEENSY++  [TEENSY++]
UP  KEYSWITCH-RGBSMDLED-MXHSPCB-1U-SMDRGB  [MXHSPCB-1U-SMDRGB]
V  KEYSWITCH-RGBSMDLED-MXHSPCB-1U-SMDRGB  [MXHSPCB-1U-SMDRGB]
W  KEYSWITCH-RGBSMDLED-MXHSPCB-1U-SMDRGB  [MXHSPCB-1U-SMDRGB]
WIN  KEYSWITCH-RGBSMDLED-MXHSPCB-1U-SMDRGB  [MXHSPCB-1U-SMDRGB]
X  KEYSWITCH-RGBSMDLED-MXHSPCB-1U-SMDRGB  [MXHSPCB-1U-SMDRGB]
Y  KEYSWITCH-RGBSMDLED-MXHSPCB-1U-SMDRGB  [MXHSPCB-1U-SMDRGB]
Z  KEYSWITCH-RGBSMDLED-MXHSPCB-1U-SMDRGB  [MXHSPCB-1U-SMDRGB]
~  KEYSWITCH-RGBSMDLED-MXHSPCB-1U-SMDRGB  [MXHSPCB-1U-SMDRGB]

## Nets
B: 0.B- 0NP.B- 1.B- 1NP.B- 2.B- 2NP.B- 3.B- 3NP.B- 4.B- 4NP.B- 5.B- 5NP.B- 6.B- 6NP.B- 7.B- 7NP.B- 8.B- 8NP.B- 9.B- 9NP.B- '.B- *NP.B- +NP.B- ,.B- ,NP.B- -.B- -NP.B- ..B- /.B- /NP.B- =.B- [.B- ].B- A.B- ALT1.B- ALT2.B- B.B- BACKSLASH.B- BACKSPACE.B- C.B- CAPSLOCK.B- CTRL1.B- CTRL2.B- D.B- DEL.B- DOWN.B- E.B- END.B- ENTER.B- ENTERNP.B- ESC.B- F1.B- F2.B- F3.B- F4.B- F5.B- F6.B- F7.B- F8.B- F9.B- F10.B- F11.B- F12.B- F.B- FN.B- G.B- H.B- HOME.B- I.B- INS.B- J.B- JP1.3 K.B- L.B- LEFT.B- M.B- MENU.B- N.B- NUMLK.B- O.B- P.B- PAGEDOWN.B- PAGEUP.B- PAUSEBREAK.B- PRTSC.B- Q.B- R.B- RIGHT.B- S.B- SCRLK.B- SEMICOLON.B- SHIFT1.B- SHIFT2.B- SPACE.B- T.B- TAB.B- U.B- UP.B- V.B- W.B- WIN.B- X.B- Y.B- Z.B- ~.B-
G: 0.G- 0NP.G- 1.G- 1NP.G- 2.G- 2NP.G- 3.G- 3NP.G- 4.G- 4NP.G- 5.G- 5NP.G- 6.G- 6NP.G- 7.G- 7NP.G- 8.G- 8NP.G- 9.G- 9NP.G- '.G- *NP.G- +NP.G- ,.G- ,NP.G- -.G- -NP.G- ..G- /.G- /NP.G- =.G- [.G- ].G- A.G- ALT1.G- ALT2.G- B.G- BACKSLASH.G- BACKSPACE.G- C.G- CAPSLOCK.G- CTRL1.G- CTRL2.G- D.G- DEL.G- DOWN.G- E.G- END.G- ENTER.G- ENTERNP.G- ESC.G- F1.G- F2.G- F3.G- F4.G- F5.G- F6.G- F7.G- F8.G- F9.G- F10.G- F11.G- F12.G- F.G- FN.G- G.G- H.G- HOME.G- I.G- INS.G- J.G- JP1.2 K.G- L.G- LEFT.G- M.G- MENU.G- N.G- NUMLK.G- O.G- P.G- PAGEDOWN.G- PAGEUP.G- PAUSEBREAK.G- PRTSC.G- Q.G- R.G- RIGHT.G- S.G- SCRLK.G- SEMICOLON.G- SHIFT1.G- SHIFT2.G- SPACE.G- T.G- TAB.G- U.G- UP.G- V.G- W.G- WIN.G- X.G- Y.G- Z.G- ~.G-
N$1: D1.C ESC.MX2(P1)
N$2: BACKSPACE.MX2(P1) D27.C
N$3: D2.C F1.MX2(P1)
N$4: D3.C F2.MX2(P1)
N$5: D4.C F3.MX2(P1)
N$6: D5.C F4.MX2(P1)
N$7: D6.C F5.MX2(P1)
N$8: D7.C F6.MX2(P1)
N$9: D8.C F7.MX2(P1)
N$10: D9.C F8.MX2(P1)
N$11: D54.C ENTER.MX2(P1)
N$12: D10.C F9.MX2(P1)
N$13: D11.C F10.MX2(P1)
N$14: D12.C F11.MX2(P1)
N$15: D13.C F12.MX2(P1)
N$16: D14.C ~.MX2(P1)
N$17: 1.MX2(P1) D15.C
N$18: 2.MX2(P1) D16.C
N$19: 3.MX2(P1) D17.C
N$20: 4.MX2(P1) D18.C
N$21: 5.MX2(P1) D19.C
N$22: 6.MX2(P1) D20.C
N$23: 7.MX2(P1) D21.C
N$24: 8.MX2(P1) D22.C
N$25: 9.MX2(P1) D23.C
N$26: 0.MX2(P1) D24.C
N$27: -.MX2(P1) D25.C
N$29: BACKSLASH.MX2(P1) D41.C
N$30: D55.C SHIFT1.MX2(P1)
N$31: D28.C TAB.MX2(P1)
N$32: D29.C Q.MX2(P1)
N$33: D30.C W.MX2(P1)
N$34: D31.C E.MX2(P1)
N$35: D32.C R.MX2(P1)
N$36: D33.C T.MX2(P1)
N$37: D34.C Y.MX2(P1)
N$38: D35.C U.MX2(P1)
N$39: D36.C I.MX2(P1)
N$40: D37.C O.MX2(P1)
N$41: D38.C P.MX2(P1)
N$42: [.MX2(P1) D39.C
N$43: ].MX2(P1) D40.C
N$44: D66.C SHIFT2.MX2(P1)
N$45: D70.C SPACE.MX2(P1)
N$46: CAPSLOCK.MX2(P1) D42.C
N$47: A.MX2(P1) D43.C
N$48: D44.C S.MX2(P1)
N$49: D45.C D.MX2(P1)
N$50: D46.C F.MX2(P1)
N$51: D47.C G.MX2(P1)
N$52: D48.C H.MX2(P1)
N$53: D49.C J.MX2(P1)
N$54: D50.C K.MX2(P1)
N$55: D51.C L.MX2(P1)
N$56: D52.C SEMICOLON.MX2(P1)
N$57: '.MX2(P1) D53.C
N$58: D5.A D19.A D33.A D47.A D59.A D80.A D95.A U$1.F5(ADC5,PF5)
N$59: D102.C ENTERNP.MX2(P1)
N$60: 0NP.MX2(P1) D103.C
N$61: +NP.MX2(P1) D95.C
N$62: =.MX2(P1) D26.C
N$63: D56.C Z.MX2(P1)
N$64: D57.C X.MX2(P1)
N$65: C.MX2(P1) D58.C
N$66: D59.C V.MX2(P1)
N$67: B.MX2(P1) D60.C
N$68: D61.C N.MX2(P1)
N$69: D62.C M.MX2(P1)
N$70: ,.MX2(P1) D63.C
N$71: ..MX2(P1) D64.C
N$72: /.MX2(P1) D65.C
N$73: D2.A D16.A D30.A D44.A D56.A D69.A D77.A D92.A U$1.F2(ADC2,PF2)
N$74: ESC.MX1(P0) F1.MX1(P0) F2.MX1(P0) F3.MX1(P0) F4.MX1(P0) F5.MX1(P0) F6.MX1(P0) F7.MX1(P0) F8.MX1(P0) F9.MX1(P0) F10.MX1(P0) F11.MX1(P0) F12.MX1(P0) U$1.A0
N$75: 0.MX1(P0) 1.MX1(P0) 2.MX1(P0) 3.MX1(P0) 4.MX1(P0) 5.MX1(P0) 6.MX1(P0) 7.MX1(P0) 8.MX1(P0) 9.MX1(P0) -.MX1(P0) =.MX1(P0) BACKSPACE.MX1(P0) U$1.A1 ~.MX1(P0)
N$76: CTRL1.MX2(P1) D67.C
N$77: D68.C WIN.MX2(P1)
N$78: ALT1.MX2(P1) D69.C
N$79: [.MX1(P0) ].MX1(P0) BACKSLASH.MX1(P0) E.MX1(P0) I.MX1(P0) O.MX1(P0) P.MX1(P0) Q.MX1(P0) R.MX1(P0) T.MX1(P0) TAB.MX1(P0) U$1.A2 U.MX1(P0) W.MX1(P0) Y.MX1(P0)
N$80: '.MX1(P0) A.MX1(P0) CAPSLOCK.MX1(P0) D.MX1(P0) ENTER.MX1(P0) F.MX1(P0) G.MX1(P0) H.MX1(P0) J.MX1(P0) K.MX1(P0) L.MX1(P0) S.MX1(P0) SEMICOLON.MX1(P0) U$1.A3
N$81: ,.MX1(P0) ..MX1(P0) /.MX1(P0) B.MX1(P0) C.MX1(P0) M.MX1(P0) N.MX1(P0) SHIFT1.MX1(P0) SHIFT2.MX1(P0) U$1.A4 V.MX1(P0) X.MX1(P0) Z.MX1(P0)
N$82: ALT1.MX1(P0) ALT2.MX1(P0) CTRL1.MX1(P0) CTRL2.MX1(P0) FN.MX1(P0) MENU.MX1(P0) SPACE.MX1(P0) U$1.A5 WIN.MX1(P0)
N$83: /NP.MX1(P0) DEL.MX1(P0) DOWN.MX1(P0) END.MX1(P0) HOME.MX1(P0) INS.MX1(P0) LEFT.MX1(P0) NUMLK.MX1(P0) PAGEDOWN.MX1(P0) PAGEUP.MX1(P0) PAUSEBREAK.MX1(P0) PRTSC.MX1(P0) RIGHT.MX1(P0) SCRLK.MX1(P0) U$1.A6 UP.MX1(P0)
N$84: 0NP.MX1(P0) 1NP.MX1(P0) 2NP.MX1(P0) 3NP.MX1(P0) 4NP.MX1(P0) 5NP.MX1(P0) 6NP.MX1(P0) 7NP.MX1(P0) 8NP.MX1(P0) 9NP.MX1(P0) *NP.MX1(P0) +NP.MX1(P0) ,NP.MX1(P0) -NP.MX1(P0) ENTERNP.MX1(P0) U$1.A7
N$85: ALT2.MX2(P1) D71.C
N$86: D72.C FN.MX2(P1)
N$87: D1.A D14.A D28.A D42.A D55.A D67.A D75.A D90.A U$1.F0(ADC0,PF0)
N$88: D15.A D29.A D43.A D68.A D76.A D91.A U$1.F1(ADC1,PF1)
N$89: D73.C MENU.MX2(P1)
N$90: CTRL2.MX2(P1) D74.C
N$91: D75.C PRTSC.MX2(P1)
N$92: D76.C SCRLK.MX2(P1)
N$93: D77.C PAUSEBREAK.MX2(P1)
N$94: D78.C INS.MX2(P1)
N$95: D79.C HOME.MX2(P1)
N$96: D80.C PAGEUP.MX2(P1)
N$97: D81.C DEL.MX2(P1)
N$98: D82.C END.MX2(P1)
N$99: D83.C PAGEDOWN.MX2(P1)
N$100: D84.C UP.MX2(P1)
N$101: D85.C LEFT.MX2(P1)
N$102: D86.C DOWN.MX2(P1)
N$103: D87.C RIGHT.MX2(P1)
N$104: D88.C NUMLK.MX2(P1)
N$105: /NP.MX2(P1) D89.C
N$106: *NP.MX2(P1) D90.C
N$107: -NP.MX2(P1) D91.C
N$108: 7NP.MX2(P1) D92.C
N$109: 8NP.MX2(P1) D93.C
N$110: 9NP.MX2(P1) D94.C
N$112: 4NP.MX2(P1) D96.C
N$113: 5NP.MX2(P1) D97.C
N$114: 6NP.MX2(P1) D98.C
N$115: 1NP.MX2(P1) D99.C
N$116: 2NP.MX2(P1) D100.C
N$117: 3NP.MX2(P1) D101.C
N$119: D3.A D17.A D31.A D45.A D57.A D78.A D93.A U$1.F3(ADC3,PF3)
N$120: ,NP.MX2(P1) D104.C
N$121: D4.A D18.A D32.A D46.A D58.A D79.A D94.A U$1.F4(ADC4,PF4)
N$123: D6.A D20.A D34.A D48.A D60.A D81.A D96.A U$1.F6(ADC6,PF6)
N$124: D7.A D21.A D35.A D49.A D61.A D70.A D82.A D97.A U$1.F7(ADC7,PF7)
N$125: D9.A D23.A D37.A D51.A D63.A D84.A D99.A U$1.C1
N$126: D24.A D38.A D52.A D64.A D85.A D100.A U$1.C2
N$127: D10.A D25.A D39.A D53.A D65.A D71.A D86.A D101.A U$1.C3(T3,PC3)
N$128: D11.A D26.A D40.A D72.A D87.A D102.A U$1.C4(OC3C,PC4)
N$129: D12.A D73.A D88.A D103.A U$1.C5(OC3B,PC5)
N$130: D13.A D27.A D41.A D54.A D66.A D74.A D89.A D104.A U$1.C6(OC3A,PC6)
N$134: D8.A D22.A D36.A D50.A D62.A D83.A D98.A U$1.C0
R: 0.R- 0NP.R- 1.R- 1NP.R- 2.R- 2NP.R- 3.R- 3NP.R- 4.R- 4NP.R- 5.R- 5NP.R- 6.R- 6NP.R- 7.R- 7NP.R- 8.R- 8NP.R- 9.R- 9NP.R- '.R- *NP.R- +NP.R- ,.R- ,NP.R- -.R- -NP.R- ..R- /.R- /NP.R- =.R- [.R- ].R- A.R- ALT1.R- ALT2.R- B.R- BACKSLASH.R- BACKSPACE.R- C.R- CAPSLOCK.R- CTRL1.R- CTRL2.R- D.R- DEL.R- DOWN.R- E.R- END.R- ENTER.R- ENTERNP.R- ESC.R- F1.R- F2.R- F3.R- F4.R- F5.R- F6.R- F7.R- F8.R- F9.R- F10.R- F11.R- F12.R- F.R- FN.R- G.R- H.R- HOME.R- I.R- INS.R- J.R- JP1.1 K.R- L.R- LEFT.R- M.R- MENU.R- N.R- NUMLK.R- O.R- P.R- PAGEDOWN.R- PAGEUP.R- PAUSEBREAK.R- PRTSC.R- Q.R- R.R- RIGHT.R- S.R- SCRLK.R- SEMICOLON.R- SHIFT1.R- SHIFT2.R- SPACE.R- T.R- TAB.R- U.R- UP.R- V.R- W.R- WIN.R- X.R- Y.R- Z.R- ~.R-
V: 0.LED+ 0NP.LED+ 1.LED+ 1NP.LED+ 2.LED+ 2NP.LED+ 3.LED+ 3NP.LED+ 4.LED+ 4NP.LED+ 5.LED+ 5NP.LED+ 6.LED+ 6NP.LED+ 7.LED+ 7NP.LED+ 8.LED+ 8NP.LED+ 9.LED+ 9NP.LED+ '.LED+ *NP.LED+ +NP.LED+ ,.LED+ ,NP.LED+ -.LED+ -NP.LED+ ..LED+ /.LED+ /NP.LED+ =.LED+ [.LED+ ].LED+ A.LED+ ALT1.LED+ ALT2.LED+ B.LED+ BACKSLASH.LED+ BACKSPACE.LED+ C.LED+ CAPSLOCK.LED+ CTRL1.LED+ CTRL2.LED+ D.LED+ DEL.LED+ DOWN.LED+ E.LED+ END.LED+ ENTER.LED+ ENTERNP.LED+ ESC.LED+ F1.LED+ F2.LED+ F3.LED+ F4.LED+ F5.LED+ F6.LED+ F7.LED+ F8.LED+ F9.LED+ F10.LED+ F11.LED+ F12.LED+ F.LED+ FN.LED+ G.LED+ H.LED+ HOME.LED+ I.LED+ INS.LED+ J.LED+ JP1.4 K.LED+ L.LED+ LEFT.LED+ M.LED+ MENU.LED+ N.LED+ NUMLK.LED+ O.LED+ P.LED+ PAGEDOWN.LED+ PAGEUP.LED+ PAUSEBREAK.LED+ PRTSC.LED+ Q.LED+ R.LED+ RIGHT.LED+ S.LED+ SCRLK.LED+ SEMICOLON.LED+ SHIFT1.LED+ SHIFT2.LED+ SPACE.LED+ T.LED+ TAB.LED+ U.LED+ UP.LED+ V.LED+ W.LED+ WIN.LED+ X.LED+ Y.LED+ Z.LED+ ~.LED+
Unconnected: U$1.B0(SS,PB0) U$1.B1(SCLK,PB1) U$1.B2(MOSI,PB2) U$1.B3(MISO,PB3) U$1.B4(OC2A,PB4) U$1.B5(OC1A,PB5) U$1.B6(OC1B,PB6) U$1.B7(OC1C,OC0A,PB7) U$1.C7(IPC3,PC7) U$1.D0(SCL,OCB0,INT0,PD0) U$1.D1(SDA,OC2B,INT1,PD1) U$1.D2(RXD1,INT2,PD2) U$1.D3(TXD1,INT3,PD3) U$1.D4(ICP1,PD4) U$1.D5(XCK1,PD5) U$1.D6(LED,T1,PD6) U$1.D7(T0,PD7) U$1.E0 U$1.E1 U$1.E4(INT4,TOSC1,PE4) U$1.E5(INT5,TOSC2,PE5) U$1.E6(AIN0,INT6,PE6) U$1.E7(AIN1,INT7,PE7) U$1.REF(AREF) U$1.RST(_RST)

## Power pins joined to a net without a drawn wire
GND: U$1.GND U$1.GND2(GND) U$1.GRND1(GND)
VCC: U$1.5V(VCC) U$1.+5V(VCC)

## Library data of the parts
0 0NP 1 1NP 2 2NP 3 3NP 4 4NP 5 5NP 6 6NP 7 7NP 8 8NP 9 9NP ' *NP +NP , ,NP - -NP . / /NP = [ ] A ALT1 ALT2 B BACKSLASH BACKSPACE C CAPSLOCK CTRL1 CTRL2 D DEL DOWN E END ENTER ENTERNP ESC F F1-F12 FN G H HOME I INS J K L LEFT M MENU N NUMLK O P PAGEDOWN PAGEUP PAUSEBREAK PRTSC Q R RIGHT S SCRLK SEMICOLON SHIFT1 SHIFT2 SPACE T TAB U UP V W WIN X Y Z ~ = Keyboard:KEYSWITCH-RGBSMDLED
D1-D104 = SparkFun-DiscreteSemi:DIODE: Diode These are standard reverse protection diodes and small signal diodes. SparkFun Products: SparkFun SparkPunk Sound Kit <https://www.sparkfun.com/products/11177> SparkFun ESP8266 Thing <https://www.sparkfun.com/products/13231>; PROD_ID: DIO-08378
JP1 = Connector:PINHD-1X4: PIN HEADER; CATEGORY: CONNECTOR; SUB-CATEGORY: PIN-HEADER
U$1 = teensypp:C-TEENSY++